# Altium project simpleROM.PrjPcb
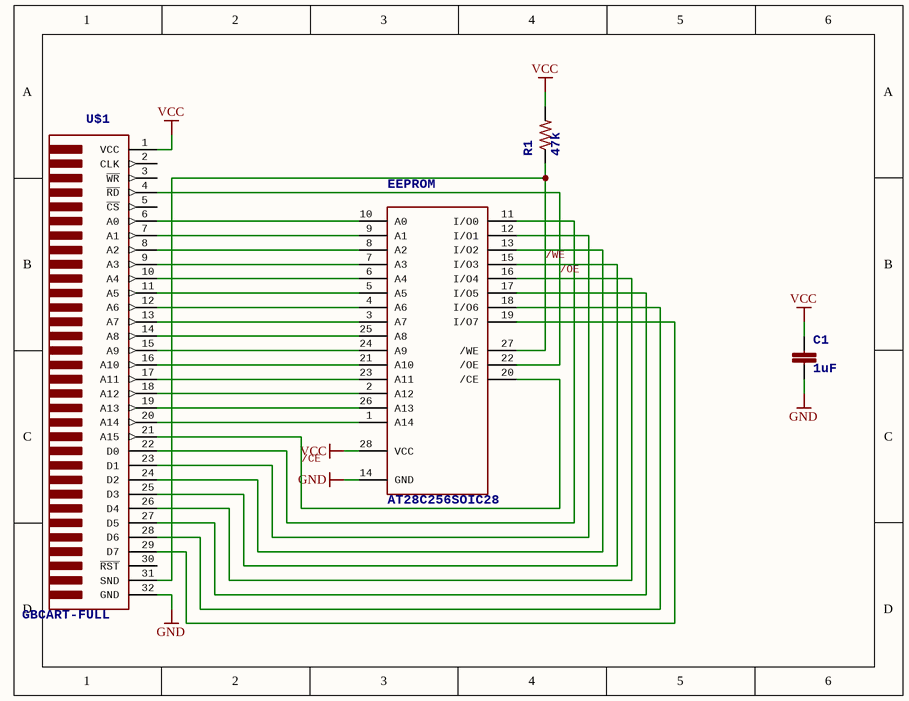
[diagram p0: simpleROM.SchDoc]
1 sheet, 4 parts. Net scope: global (net labels, ports and power ports of the same name join across sheets).
Board file: simpleROM.PcbDoc

## Sheet simpleROM.SchDoc
size 157 x 121 mm

### Parts
C1  >NAME: C1  [SPARKFUN-CAPACITORS_1206]  (hidden comment: 1uF)
EEPROM  >NAME: EEPROM  [SO28]  (hidden comment: AT28C256SOIC28)
R1  >NAME: R1  [SPARKFUN-RESISTORS_1206]  (hidden comment: 47k)
U$1  >NAME: U$1  [GBCART]  (hidden comment: GBCART-FULL)

### Nets
GND: C1.2 EEPROM.14(GND) U$1.32(GND)
VCC: C1.1 EEPROM.28(VCC) R1.2 U$1.1(VCC)
/CE: EEPROM.20(/CE) U$1.21(A15)
/OE: EEPROM.22(/OE) U$1.4(~{RD})
/WE: EEPROM.27(/WE) R1.1 U$1.31(SND)
NetEEPROM_1: EEPROM.1(A14) U$1.20(A14)
NetEEPROM_2: EEPROM.2(A12) U$1.18(A12)
NetEEPROM_3: EEPROM.3(A7) U$1.13(A7)
NetEEPROM_4: EEPROM.4(A6) U$1.12(A6)
NetEEPROM_5: EEPROM.5(A5) U$1.11(A5)
NetEEPROM_6: EEPROM.6(A4) U$1.10(A4)
NetEEPROM_7: EEPROM.7(A3) U$1.9(A3)
NetEEPROM_8: EEPROM.8(A2) U$1.8(A2)
NetEEPROM_9: EEPROM.9(A1) U$1.7(A1)
NetEEPROM_10: EEPROM.10(A0) U$1.6(A0)
NetEEPROM_11: EEPROM.11(I/O0) U$1.22(D0)
NetEEPROM_12: EEPROM.12(I/O1) U$1.23(D1)
NetEEPROM_13: EEPROM.13(I/O2) U$1.24(D2)
NetEEPROM_15: EEPROM.15(I/O3) U$1.25(D3)
NetEEPROM_16: EEPROM.16(I/O4) U$1.26(D4)
NetEEPROM_17: EEPROM.17(I/O5) U$1.27(D5)
NetEEPROM_18: EEPROM.18(I/O6) U$1.28(D6)
NetEEPROM_19: EEPROM.19(I/O7) U$1.29(D7)
NetEEPROM_21: EEPROM.21(A10) U$1.16(A10)
NetEEPROM_23: EEPROM.23(A11) U$1.17(A11)
NetEEPROM_24: EEPROM.24(A9) U$1.15(A9)
NetEEPROM_25: EEPROM.25(A8) U$1.14(A8)
NetEEPROM_26: EEPROM.26(A13) U$1.19(A13)

Not connected (* = marked no-connect by the designer): U$1 2(CLK) 3(~{WR}) 5(~{CS}) 30(~{RST})

### Library data of the parts
C1 = SPARKFUN-CAPACITORS_CAP1206: <b>Capacitor</b> / Standard 0603 ceramic capacitor, and 0.1" leaded capacitor.; >VALUE: 1uF
R1 = SPARKFUN-RESISTORS_RESISTOR1206: <b>Resistor</b> / Basic schematic elements and footprints for 0603, 1206, and PTH resistors.; >VALUE: 47k
EEPROM = AT28C256SOIC28: >VALUE: AT28C256SOIC28
U$1 = GBCART-FULL: >VALUE: GBCART-FULL